# Altium schematic sheet Sheet1.SchDoc
size A4
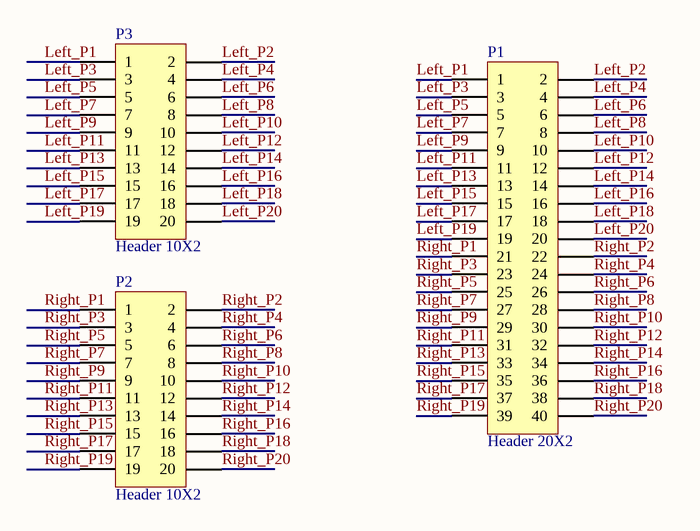
[diagram p0: Sheet1.SchDoc]

## Parts
P1  Header 20X2  [BTB0.8con40Pin]
P2  Header 10X2  [HDR2X10]
P3  Header 10X2  [HDR2X10]

## Nets
Left_P1: P1.1 P3.1
Left_P2: P1.2 P3.2
Left_P3: P1.3 P3.3
Left_P4: P1.4 P3.4
Left_P5: P1.5 P3.5
Left_P6: P1.6 P3.6
Left_P7: P1.7 P3.7
Left_P8: P1.8 P3.8
Left_P9: P1.9 P3.9
Left_P10: P1.10 P3.10
Left_P11: P1.11 P3.11
Left_P12: P1.12 P3.12
Left_P13: P1.13 P3.13
Left_P14: P1.14 P3.14
Left_P15: P1.15 P3.15
Left_P16: P1.16 P3.16
Left_P17: P1.17 P3.17
Left_P18: P1.18 P3.18
Left_P19: P1.19 P3.19
Left_P20: P1.20 P3.20
Right_P1: P1.21 P2.1
Right_P2: P1.22 P2.2
Right_P3: P1.23 P2.3
Right_P4: P1.24 P2.4
Right_P5: P1.25 P2.5
Right_P6: P1.26 P2.6
Right_P7: P1.27 P2.7
Right_P8: P1.28 P2.8
Right_P9: P1.29 P2.9
Right_P10: P1.30 P2.10
Right_P11: P1.31 P2.11
Right_P12: P1.32 P2.12
Right_P13: P1.33 P2.13
Right_P14: P1.34 P2.14
Right_P15: P1.35 P2.15
Right_P16: P1.36 P2.16
Right_P17: P1.37 P2.17
Right_P18: P1.38 P2.18
Right_P19: P1.39 P2.19
Right_P20: P1.40 P2.20

## Library data of the parts
P1 = Header 20X2: Header, 20-Pin, Dual row; LatestRevisionDate: 17-Jul-2002; LatestRevisionNote: Re-released for DXP Platform.; Publisher: Altium Limited
P2 P3 = Header 10X2: Header, 10-Pin, Dual row; LatestRevisionDate: 17-Jul-2002; LatestRevisionNote: Re-released for DXP Platform.; Publisher: Altium Limited